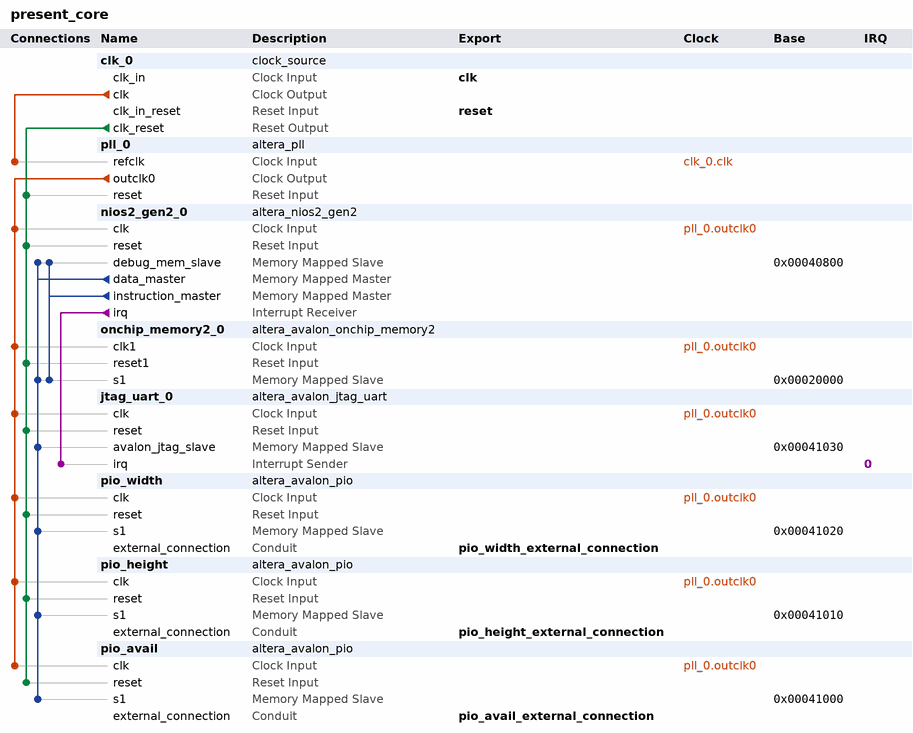
[diagram p0: system contents]
# Platform Designer (Qsys) system present_core, Cyclone V 5CEBA4F23C7
# Parameters at their usual value, and those the tool derives, are not listed.
package require -exact qsys 16.0
create_system present_core
set_project_property DEVICE_FAMILY {Cyclone V}
set_project_property DEVICE 5CEBA4F23C7

add_instance clk_0 clock_source 16.0
set_instance_parameter_value clk_0 clockFrequency 50000000

add_instance pll_0 altera_pll 16.0
set_instance_parameter_value pll_0 gui_device_speed_grade 1
set_instance_parameter_value pll_0 gui_number_of_clocks 1
set_instance_parameter_value pll_0 gui_operation_mode direct
set_instance_parameter_value pll_0 gui_output_clock_frequency0 100.0
set_instance_parameter_value pll_0 gui_pll_mode {Integer-N PLL}
set_instance_parameter_value pll_0 gui_reference_clock_frequency 50.0
set_instance_parameter_value pll_0 gui_use_locked true

add_instance nios2_gen2_0 altera_nios2_gen2 16.0
set_instance_parameter_value nios2_gen2_0 dcache_size 2048
set_instance_parameter_value nios2_gen2_0 exceptionSlave onchip_memory2_0.s1
set_instance_parameter_value nios2_gen2_0 icache_size 4096
set_instance_parameter_value nios2_gen2_0 impl Tiny
set_instance_parameter_value nios2_gen2_0 resetSlave onchip_memory2_0.s1

add_instance onchip_memory2_0 altera_avalon_onchip_memory2 16.0
set_instance_parameter_value onchip_memory2_0 dataWidth 32
set_instance_parameter_value onchip_memory2_0 dualPort false
set_instance_parameter_value onchip_memory2_0 initMemContent true
set_instance_parameter_value onchip_memory2_0 initializationFileName onchip_mem.hex
set_instance_parameter_value onchip_memory2_0 memorySize 131072

add_instance jtag_uart_0 altera_avalon_jtag_uart 16.0
set_instance_parameter_value jtag_uart_0 simInteractiveOptions NO_INTERACTIVE_WINDOWS

add_instance pio_width altera_avalon_pio 16.0
set_instance_parameter_value pio_width direction Output
set_instance_parameter_value pio_width width 32

add_instance pio_height altera_avalon_pio 16.0
set_instance_parameter_value pio_height direction Output
set_instance_parameter_value pio_height width 32

add_instance pio_avail altera_avalon_pio 16.0
set_instance_parameter_value pio_avail direction Output
set_instance_parameter_value pio_avail width 32

# connections
add_connection clk_0.clk pll_0.refclk clock
add_connection pll_0.outclk0 jtag_uart_0.clk clock
add_connection pll_0.outclk0 nios2_gen2_0.clk clock
add_connection pll_0.outclk0 onchip_memory2_0.clk1 clock
add_connection pll_0.outclk0 pio_avail.clk clock
add_connection pll_0.outclk0 pio_height.clk clock
add_connection pll_0.outclk0 pio_width.clk clock
add_connection clk_0.clk_reset jtag_uart_0.reset reset
add_connection clk_0.clk_reset nios2_gen2_0.reset reset
add_connection clk_0.clk_reset onchip_memory2_0.reset1 reset
add_connection clk_0.clk_reset pio_avail.reset reset
add_connection clk_0.clk_reset pio_height.reset reset
add_connection clk_0.clk_reset pio_width.reset reset
add_connection clk_0.clk_reset pll_0.reset reset
add_connection nios2_gen2_0.data_master jtag_uart_0.avalon_jtag_slave avalon
set_connection_parameter_value nios2_gen2_0.data_master/jtag_uart_0.avalon_jtag_slave baseAddress 0x00041030
add_connection nios2_gen2_0.data_master nios2_gen2_0.debug_mem_slave avalon
set_connection_parameter_value nios2_gen2_0.data_master/nios2_gen2_0.debug_mem_slave baseAddress 0x00040800
add_connection nios2_gen2_0.data_master onchip_memory2_0.s1 avalon
set_connection_parameter_value nios2_gen2_0.data_master/onchip_memory2_0.s1 baseAddress 0x00020000
add_connection nios2_gen2_0.data_master pio_avail.s1 avalon
set_connection_parameter_value nios2_gen2_0.data_master/pio_avail.s1 baseAddress 0x00041000
add_connection nios2_gen2_0.data_master pio_height.s1 avalon
set_connection_parameter_value nios2_gen2_0.data_master/pio_height.s1 baseAddress 0x00041010
add_connection nios2_gen2_0.data_master pio_width.s1 avalon
set_connection_parameter_value nios2_gen2_0.data_master/pio_width.s1 baseAddress 0x00041020
add_connection nios2_gen2_0.instruction_master nios2_gen2_0.debug_mem_slave avalon
set_connection_parameter_value nios2_gen2_0.instruction_master/nios2_gen2_0.debug_mem_slave baseAddress 0x00040800
add_connection nios2_gen2_0.instruction_master onchip_memory2_0.s1 avalon
set_connection_parameter_value nios2_gen2_0.instruction_master/onchip_memory2_0.s1 baseAddress 0x00020000
add_connection nios2_gen2_0.irq jtag_uart_0.irq interrupt
set_connection_parameter_value nios2_gen2_0.irq/jtag_uart_0.irq irqNumber 0

# exported interfaces
add_interface clk clock sink
set_interface_property clk EXPORT_OF clk_0.clk_in
add_interface pio_avail_external_connection conduit end
set_interface_property pio_avail_external_connection EXPORT_OF pio_avail.external_connection
add_interface pio_height_external_connection conduit end
set_interface_property pio_height_external_connection EXPORT_OF pio_height.external_connection
add_interface pio_width_external_connection conduit end
set_interface_property pio_width_external_connection EXPORT_OF pio_width.external_connection
add_interface reset reset sink
set_interface_property reset EXPORT_OF clk_0.clk_in_reset

set_interconnect_requirement {$system} qsys_mm.clockCrossingAdapter HANDSHAKE
set_interconnect_requirement {$system} qsys_mm.enableEccProtection FALSE
set_interconnect_requirement {$system} qsys_mm.insertDefaultSlave FALSE
set_interconnect_requirement {$system} qsys_mm.maxAdditionalLatency 1

save_system present_core.qsys
